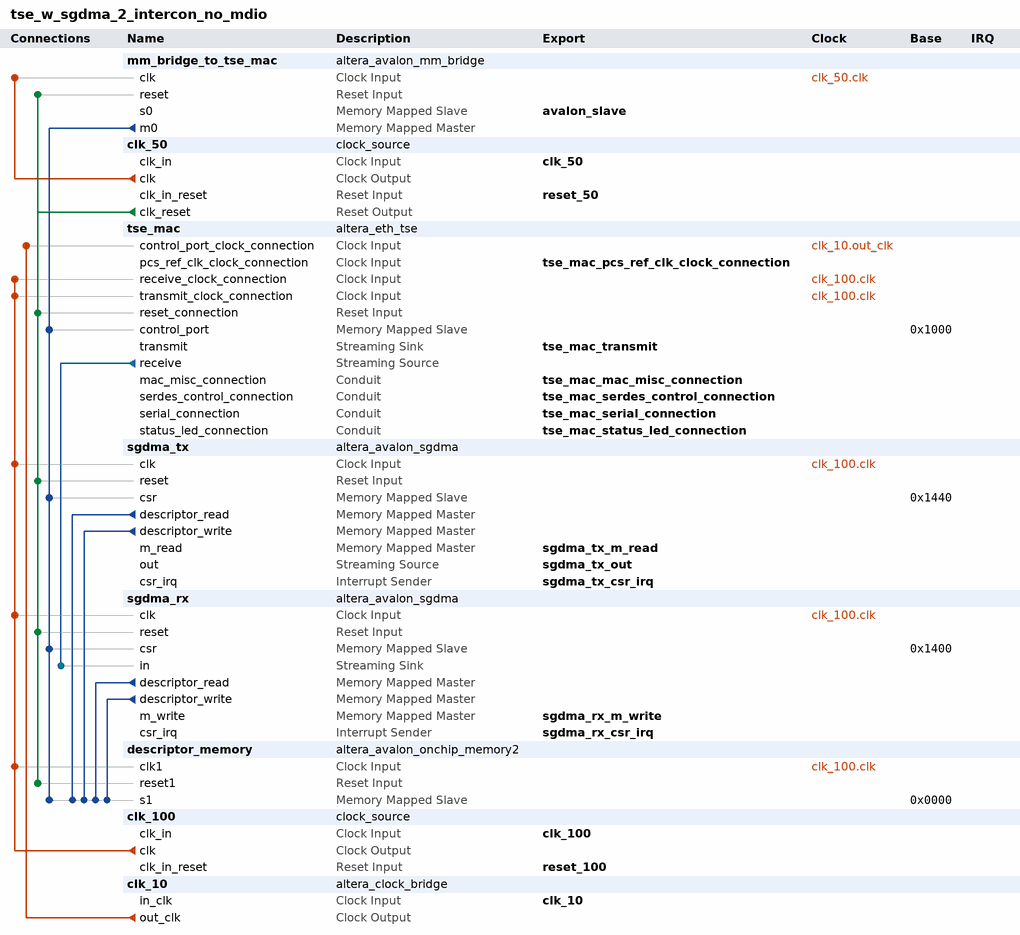
[diagram p0: system contents]
# Platform Designer (Qsys) system tse_w_sgdma_2_intercon_no_mdio, Arria V 5AGXFB3H4F35C4
# Parameters at their usual value, and those the tool derives, are not listed.
package require -exact qsys 14.1
create_system tse_w_sgdma_2_intercon_no_mdio
set_project_property DEVICE_FAMILY {Arria V}
set_project_property DEVICE 5AGXFB3H4F35C4

add_instance mm_bridge_to_tse_mac altera_avalon_mm_bridge 14.1
set_instance_parameter_value mm_bridge_to_tse_mac ADDRESS_UNITS SYMBOLS
set_instance_parameter_value mm_bridge_to_tse_mac ADDRESS_WIDTH 13
set_instance_parameter_value mm_bridge_to_tse_mac DATA_WIDTH 32
set_instance_parameter_value mm_bridge_to_tse_mac MAX_BURST_SIZE 4
set_instance_parameter_value mm_bridge_to_tse_mac MAX_PENDING_RESPONSES 4
set_instance_parameter_value mm_bridge_to_tse_mac USE_AUTO_ADDRESS_WIDTH 0

add_instance clk_50 clock_source 14.1
set_instance_parameter_value clk_50 clockFrequency 50000000

add_instance tse_mac altera_eth_tse 14.1
set_instance_parameter_value tse_mac core_variation MAC_PCS
set_instance_parameter_value tse_mac enable_hd_logic false
set_instance_parameter_value tse_mac enable_mac_flow_ctrl true
set_instance_parameter_value tse_mac enable_magic_detect false
set_instance_parameter_value tse_mac enable_sgmii true
set_instance_parameter_value tse_mac enable_shift16 true
set_instance_parameter_value tse_mac ifGMII MII_GMII
set_instance_parameter_value tse_mac ing_addr 11
set_instance_parameter_value tse_mac mdio_clk_div 200
set_instance_parameter_value tse_mac phyip_pma_bonding_mode xN
set_instance_parameter_value tse_mac stat_cnt_ena false
set_instance_parameter_value tse_mac transceiver_type GXB
set_instance_parameter_value tse_mac useMDIO false

add_instance sgdma_tx altera_avalon_sgdma 14.1
set_instance_parameter_value sgdma_tx enableBurstTransfers false
set_instance_parameter_value sgdma_tx enableUnalignedTransfers false
set_instance_parameter_value sgdma_tx readBlockDataWidth 32
set_instance_parameter_value sgdma_tx sinkErrorWidth 0
set_instance_parameter_value sgdma_tx sourceErrorWidth 0
set_instance_parameter_value sgdma_tx transferMode MEMORY_TO_STREAM
set_instance_parameter_value sgdma_tx writeBurstcountWidth 4

add_instance sgdma_rx altera_avalon_sgdma 14.1
set_instance_parameter_value sgdma_rx enableBurstTransfers false
set_instance_parameter_value sgdma_rx enableUnalignedTransfers false
set_instance_parameter_value sgdma_rx readBlockDataWidth 32
set_instance_parameter_value sgdma_rx sinkErrorWidth 6
set_instance_parameter_value sgdma_rx sourceErrorWidth 0
set_instance_parameter_value sgdma_rx transferMode STREAM_TO_MEMORY
set_instance_parameter_value sgdma_rx writeBurstcountWidth 4

add_instance descriptor_memory altera_avalon_onchip_memory2 14.1
set_instance_parameter_value descriptor_memory dataWidth 32
set_instance_parameter_value descriptor_memory dualPort false
set_instance_parameter_value descriptor_memory initMemContent true
set_instance_parameter_value descriptor_memory initializationFileName descriptor_memory
set_instance_parameter_value descriptor_memory memorySize 4096

add_instance clk_100 clock_source 14.1
set_instance_parameter_value clk_100 clockFrequency 100000000

add_instance clk_10 altera_clock_bridge 14.1
set_instance_parameter_value clk_10 DERIVED_CLOCK_RATE 0
set_instance_parameter_value clk_10 EXPLICIT_CLOCK_RATE 10000000

# connections
add_connection clk_10.out_clk tse_mac.control_port_clock_connection clock
add_connection clk_50.clk mm_bridge_to_tse_mac.clk clock
add_connection clk_100.clk descriptor_memory.clk1 clock
add_connection clk_100.clk sgdma_rx.clk clock
add_connection clk_100.clk sgdma_tx.clk clock
add_connection clk_100.clk tse_mac.receive_clock_connection clock
add_connection clk_100.clk tse_mac.transmit_clock_connection clock
add_connection clk_50.clk_reset descriptor_memory.reset1 reset
add_connection clk_50.clk_reset mm_bridge_to_tse_mac.reset reset
add_connection clk_50.clk_reset sgdma_rx.reset reset
add_connection clk_50.clk_reset sgdma_tx.reset reset
add_connection clk_50.clk_reset tse_mac.reset_connection reset
add_connection mm_bridge_to_tse_mac.m0 descriptor_memory.s1 avalon
set_connection_parameter_value mm_bridge_to_tse_mac.m0/descriptor_memory.s1 baseAddress 0x0000
add_connection mm_bridge_to_tse_mac.m0 sgdma_rx.csr avalon
set_connection_parameter_value mm_bridge_to_tse_mac.m0/sgdma_rx.csr baseAddress 0x1400
add_connection mm_bridge_to_tse_mac.m0 sgdma_tx.csr avalon
set_connection_parameter_value mm_bridge_to_tse_mac.m0/sgdma_tx.csr baseAddress 0x1440
add_connection mm_bridge_to_tse_mac.m0 tse_mac.control_port avalon
set_connection_parameter_value mm_bridge_to_tse_mac.m0/tse_mac.control_port baseAddress 0x1000
add_connection sgdma_rx.descriptor_read descriptor_memory.s1 avalon
set_connection_parameter_value sgdma_rx.descriptor_read/descriptor_memory.s1 baseAddress 0x0000
add_connection sgdma_rx.descriptor_write descriptor_memory.s1 avalon
set_connection_parameter_value sgdma_rx.descriptor_write/descriptor_memory.s1 baseAddress 0x0000
add_connection sgdma_tx.descriptor_read descriptor_memory.s1 avalon
set_connection_parameter_value sgdma_tx.descriptor_read/descriptor_memory.s1 baseAddress 0x0000
add_connection sgdma_tx.descriptor_write descriptor_memory.s1 avalon
set_connection_parameter_value sgdma_tx.descriptor_write/descriptor_memory.s1 baseAddress 0x0000
add_connection tse_mac.receive sgdma_rx.in avalon_streaming

# exported interfaces
add_interface avalon_slave avalon slave
set_interface_property avalon_slave EXPORT_OF mm_bridge_to_tse_mac.s0
add_interface clk_10 clock sink
set_interface_property clk_10 EXPORT_OF clk_10.in_clk
add_interface clk_100 clock sink
set_interface_property clk_100 EXPORT_OF clk_100.clk_in
add_interface clk_50 clock sink
set_interface_property clk_50 EXPORT_OF clk_50.clk_in
add_interface reset_100 reset sink
set_interface_property reset_100 EXPORT_OF clk_100.clk_in_reset
add_interface reset_50 reset sink
set_interface_property reset_50 EXPORT_OF clk_50.clk_in_reset
add_interface sgdma_rx_csr_irq interrupt sender
set_interface_property sgdma_rx_csr_irq EXPORT_OF sgdma_rx.csr_irq
add_interface sgdma_rx_m_write avalon master
set_interface_property sgdma_rx_m_write EXPORT_OF sgdma_rx.m_write
add_interface sgdma_tx_csr_irq interrupt sender
set_interface_property sgdma_tx_csr_irq EXPORT_OF sgdma_tx.csr_irq
add_interface sgdma_tx_m_read avalon master
set_interface_property sgdma_tx_m_read EXPORT_OF sgdma_tx.m_read
add_interface sgdma_tx_out avalon_streaming source
set_interface_property sgdma_tx_out EXPORT_OF sgdma_tx.out
add_interface tse_mac_mac_misc_connection conduit end
set_interface_property tse_mac_mac_misc_connection EXPORT_OF tse_mac.mac_misc_connection
add_interface tse_mac_pcs_ref_clk_clock_connection clock sink
set_interface_property tse_mac_pcs_ref_clk_clock_connection EXPORT_OF tse_mac.pcs_ref_clk_clock_connection
add_interface tse_mac_serdes_control_connection conduit end
set_interface_property tse_mac_serdes_control_connection EXPORT_OF tse_mac.serdes_control_connection
add_interface tse_mac_serial_connection conduit end
set_interface_property tse_mac_serial_connection EXPORT_OF tse_mac.serial_connection
add_interface tse_mac_status_led_connection conduit end
set_interface_property tse_mac_status_led_connection EXPORT_OF tse_mac.status_led_connection
add_interface tse_mac_transmit avalon_streaming sink
set_interface_property tse_mac_transmit EXPORT_OF tse_mac.transmit

set_interconnect_requirement {$system} qsys_mm.clockCrossingAdapter AUTO
set_interconnect_requirement {$system} qsys_mm.maxAdditionalLatency 2

save_system tse_w_sgdma_2_intercon_no_mdio.qsys
